# EAGLE design wifi (EAGLE 7.1.0)
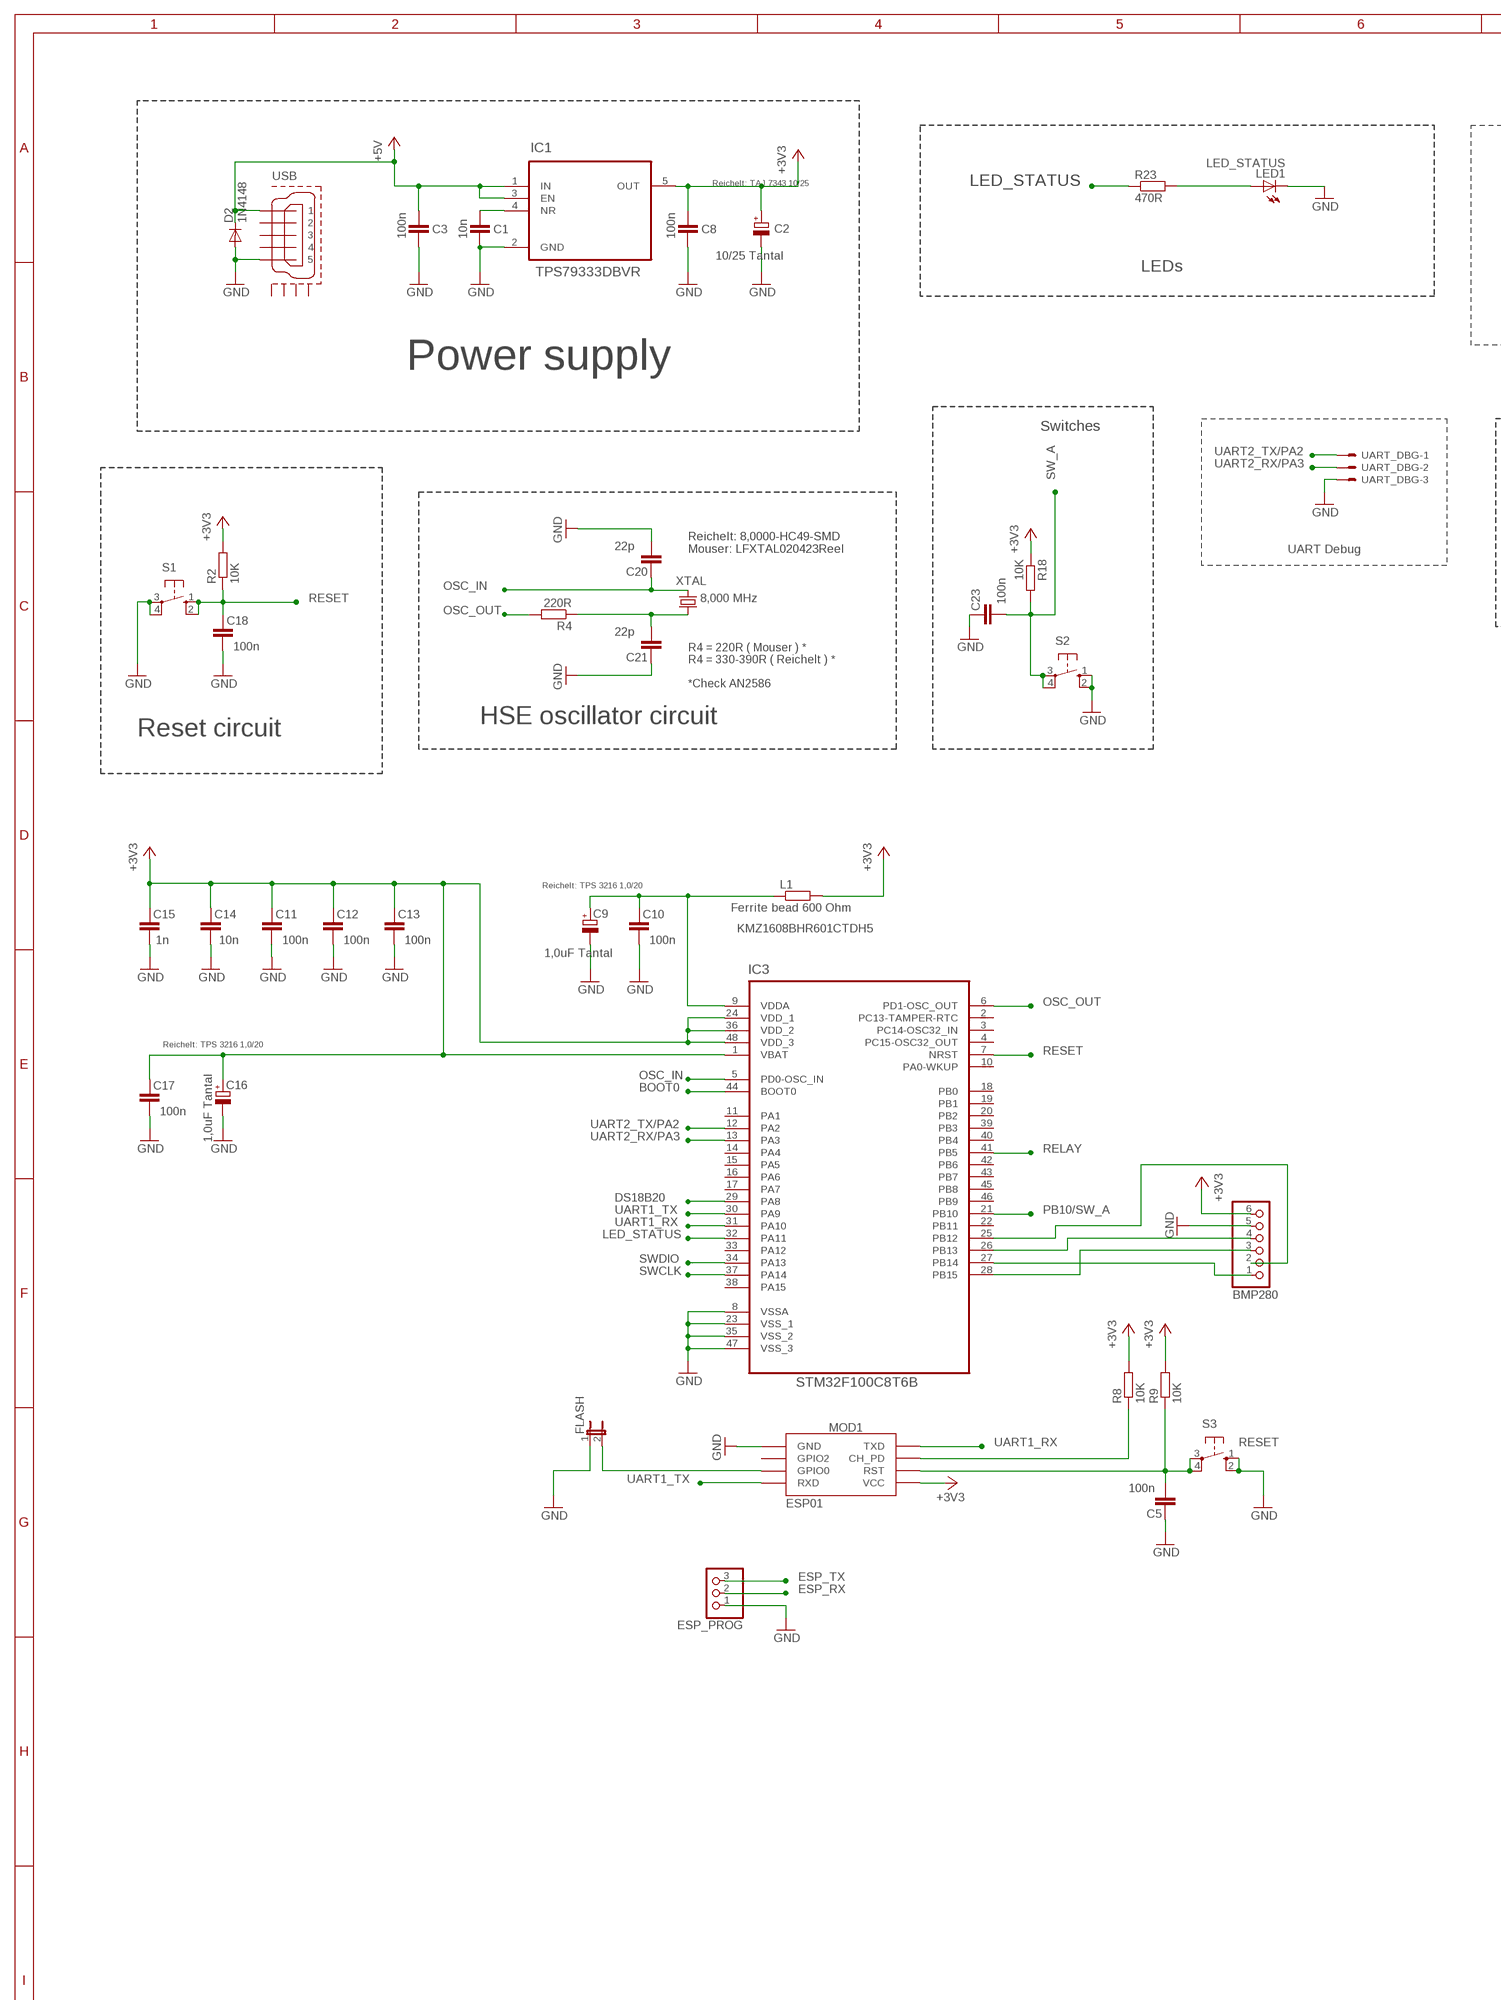
[diagram p0: schematic, sheet 1, part 1 of 2]
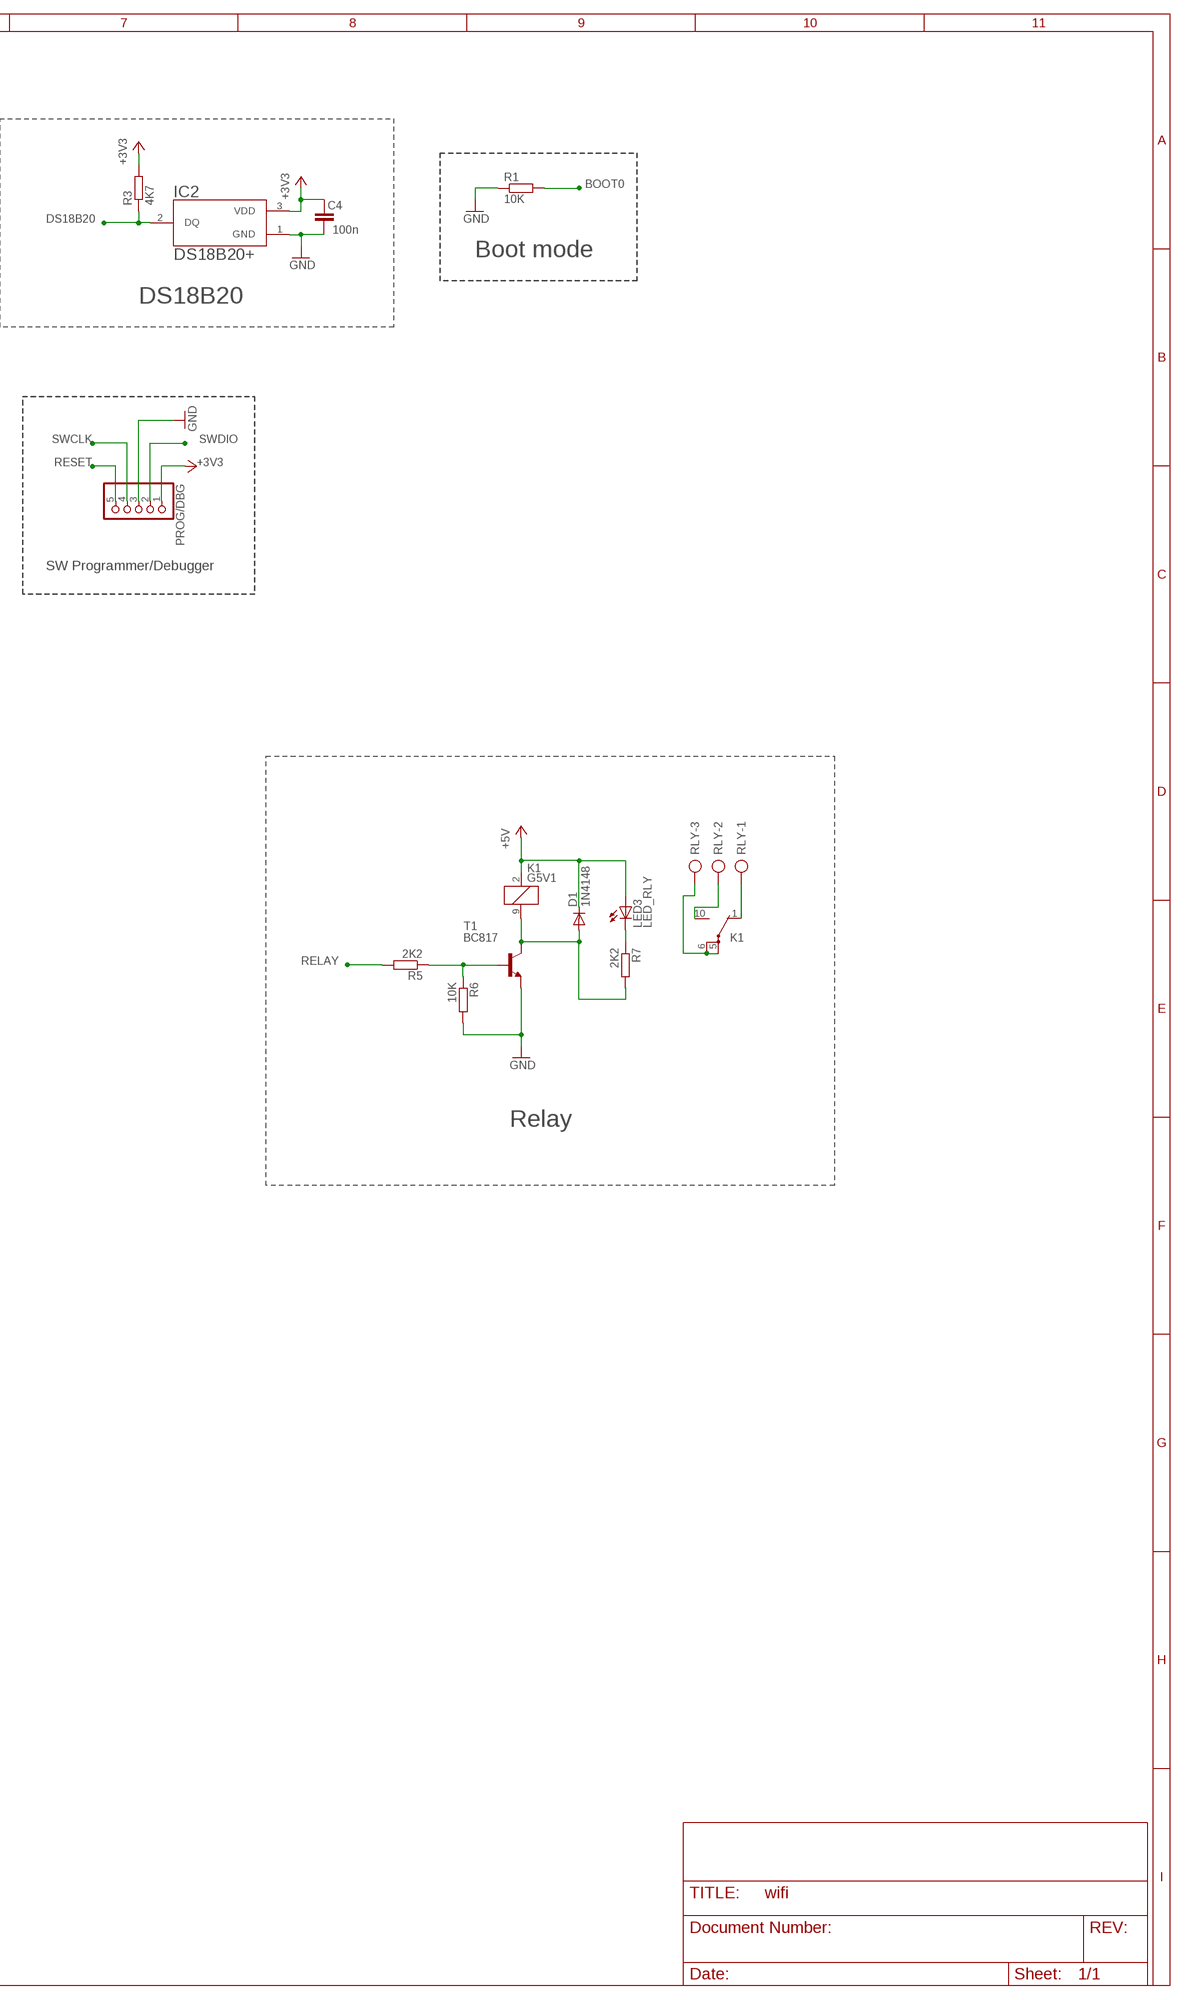
[diagram p1: schematic, sheet 1, part 2 of 2]

## Parts
BMP280  PINHD-1X6  [1X06]
C1  10n  C-EUC0805  [C0805]
C2  10/25 Tantal  CPOL-EUSMCD  [SMC_D]
C3  100n  C-EUC0805  [C0805]
C4  100n  C-EUC0805  [C0805]
C5  100n  C-EUC0805  [C0805]
C8  100n  C-EUC0805  [C0805]
C9  1,0uF Tantal  CPOL-EUSMCA  [SMC_A]
C10  100n  C-EUC0402K  [C0402K]
C11  100n  C-EUC0402K  [C0402K]
C12  100n  C-EUC0402K  [C0402K]
C13  100n  C-EUC0402K  [C0402K]
C14  10n  C-EUC0402K  [C0402K]
C15  1n  C-EUC0402K  [C0402K]
C16  1,0uF Tantal  CPOL-EUSMCA  [SMC_A]
C17  100n  C-EUC0402K  [C0402K]
C18  100n  C-EUC0603K  [C0603K]
C20  22p  C-EUC0603K  [C0603K]
C21  22p  C-EUC0603K  [C0603K]
C23  100n  C-EUC0805  [C0805]
D1  1N4148  1N4148DO35-7  [DO35-7]
D2  1N4148  1N4148DO35-7  [DO35-7]
ESP_PROG  PINHD-1X3  [1X03]
FLASH  JP1E  [JP1]
IC1  TPS79333DBVR  [SOT95P280X145-5N]
IC2  DS18B20+  [TO-92]
IC3  STM32F100C8T6B  [QFP50P900X900X160-48N]
K1  G5V1  [G5V1]
L1  Ferrite bead 600 Ohm  R-EU_R0603  [R0603]
LED1  LED_STATUS  LED3MM  [LED3MM]
LED3  LED_RLY  LED3MM  [LED3MM]
MOD1  ESP01  [ESP01]
PROG/DBG  PINHD-1X5  [1X05]
R1  10K  R-EU_R0805  [R0805]
R2  10K  R-EU_R0603  [R0603]
R3  4K7  R-EU_R0603  [R0603]
R4  220R  R-EU_R0603  [R0603]
R5  2K2  R-EU_R0603  [R0603]
R6  10K  R-EU_R0603  [R0603]
R7  2K2  R-EU_R0805  [R0805]
R8  10K  R-EU_R0603  [R0603]
R9  10K  R-EU_R0603  [R0603]
R18  10K  R-EU_M0805  [M0805]
R23  470R  R-EU_R0805  [R0805]
RLY  AK300/3  [AK300/3]
S1  10-XX  [B3F-10XX]
S2  10-XX  [B3F-10XX]
S3  10-XX  [B3F-10XX]
T1  BC817  BC817-25SMD  [SOT23-BEC]
UART_DBG  22-23-2031  [22-23-2031]
USB  MICRO-USB-RECEPTACLE47589-0001  [47589-0001]
XTAL  8,000 MHz  CRYSTALSM49  [SM49]

## Nets
+3V3: BMP280.6 C2.+ C4.1 C8.1 C11.1 C12.1 C13.1 C14.1 C15.1 C16.+ C17.1 IC1.5(OUT) IC2.3(VDD) IC3.1(VBAT) IC3.24(VDD_1) IC3.36(VDD_2) IC3.48(VDD_3) L1.2 MOD1.VCC PROG/DBG.1 R2.2 R3.2 R8.2 R9.2 R18.1
+5V: C3.1 D1.C D2.C IC1.1(IN) IC1.3(EN) K1.2 LED3.A USB.1
BOOT0: IC3.44(BOOT0) R1.2
DS18B20: IC2.2(DQ) IC3.29(PA8) R3.1
GND: BMP280.5 C1.2 C2.- C3.2 C4.2 C5.1 C8.2 C9.- C10.2 C11.2 C12.2 C13.2 C14.2 C15.2 C16.- C17.2 C18.2 C20.2 C21.1 C23.1 D2.A ESP_PROG.1 FLASH.1 IC1.2(GND) IC2.1(GND) IC3.8(VSSA) IC3.23(VSS_1) IC3.35(VSS_2) IC3.47(VSS_3) LED1.K(C) MOD1.GND PROG/DBG.3 R1.1 R6.2 S1.3(P) S1.4(P1) S2.1(S) S2.2(S1) S3.1(S) S3.2(S1) T1.E UART_DBG.3 USB.5
LED_STATUS: IC3.32(PA11) R23.1
N$2: C1.1 IC1.4(NR)
N$3: K1.1(2:O) RLY.1
N$4: C9.+ C10.1 IC3.9(VDDA) L1.1
N$5: K1.10(2:S) RLY.2
N$6: K1.5(2:P) K1.6(2:P) RLY.3
N$7: C21.2 R4.1 XTAL.2
N$8: D1.A K1.9 R7.2 T1.C
N$9: R5.1 R6.1 T1.B
N$10: LED3.K(C) R7.1
N$11: FLASH.2 MOD1.GPIO0
N$12: MOD1.CH_PD R8.1
N$13: C5.2 MOD1.RST R9.1 S3.3(P) S3.4(P1)
N$14: BMP280.4 IC3.26(PB13)
N$15: BMP280.3 IC3.28(PB15)
N$16: BMP280.2 IC3.25(PB12)
N$17: BMP280.1 IC3.27(PB14)
N$32: LED1.A R23.2
OSC_IN: C20.1 IC3.5(PD0-OSC_IN) XTAL.1
OSC_OUT: IC3.6(PD1-OSC_OUT) R4.2
PB10: C23.2 IC3.21(PB10) R18.2 S2.3(P) S2.4(P1)
RELAY: IC3.41(PB5) R5.2
RESET: C18.1 IC3.7(NRST) PROG/DBG.5 R2.1 S1.1(S) S1.2(S1)
SWCLK: IC3.37(PA14) PROG/DBG.4
SWDIO: IC3.34(PA13) PROG/DBG.2
UART1_RX: ESP_PROG.3 IC3.31(PA10) MOD1.TX(TXD)
UART1_TX: ESP_PROG.2 IC3.30(PA9) MOD1.RX(RXD)
UART2_RX: IC3.13(PA3) UART_DBG.2
UART2_TX: IC3.12(PA2) UART_DBG.1
Unconnected: IC3.2(PC13-TAMPER-RTC) IC3.3(PC14-OSC32_IN) IC3.4(PC15-OSC32_OUT) IC3.10(PA0-WKUP) IC3.11(PA1) IC3.14(PA4) IC3.15(PA5) IC3.16(PA6) IC3.17(PA7) IC3.18(PB0) IC3.19(PB1) IC3.20(PB2) IC3.22(PB11) IC3.33(PA12) IC3.38(PA15) IC3.39(PB3) IC3.40(PB4) IC3.42(PB6) IC3.43(PB7) IC3.45(PB8) IC3.46(PB9) MOD1.GPIO2 USB.2 USB.3 USB.4 USB.CASING1(GND1) USB.CASING2(GND2) USB.CASING3(GND3) USB.CASING4(GND4)

## Notes on the sheet
- Reichelt: TAJ 7343 10/25 | LED_STATUS
- BOOT0
- DS18B20
- LEDs | Boot mode
- DS18B20
- Power supply
- Switches
- UART2_TX/PA2
- UART2_RX/PA3 | SWCLK | SWDIO
- SW_A
- RESET
- Reichelt: 8,0000-HC49-SMD
  Mouser: LFXTAL020423Reel
- UART Debug
- OSC_IN
- RESET | SW Programmer/Debugger
- OSC_OUT
- R4 = 220R ( Mouser ) *
  R4 = 330-390R ( Reichelt ) *
  
  *Check AN2586
- HSE oscillator circuit
- Reset circuit
- Reichelt: TPS 3216 1,0/20
- KMZ1608BHR601CTDH5
- OSC_OUT
- RELAY
- Reichelt: TPS 3216 1,0/20
- RESET
- OSC_IN
- BOOT0
- UART2_TX/PA2
- UART2_RX/PA3
- RELAY
- Relay
- DS18B20
- UART1_TX | PB10/SW_A
- UART1_RX
- LED_STATUS
- SWDIO
- SWCLK
- PC13
- UART2_TX | PB3
- UART2_RX | PB4 | UART1_RX | RESET
- PB6/CA_CH1
- UART1_TX | PB7/CA_CH3
- PB10/SW_A
- PB11/SW_B
- ESP_TX
- ESP_RX

## Library data of the parts
BMP280 = pinhead:PINHD-1X6: PIN HEADER
C1 C3-C5 C8 C10-C15 C17 C18 C20 C21 C23 = resistor:C-EU: CAPACITOR, European symbol; SPICEPREFIX: C
C2 C9 C16 = resistor:CPOL-EU: POLARIZED CAPACITOR, European symbol
D1 D2 = diode:1N4148: DIODE high speed (Philips)
ESP_PROG = pinhead:PINHD-1X3: PIN HEADER
FLASH = jumper:JP1E: JUMPER
IC1 = TPS79333DBVR:TPS79333DBVR: LOW-DROPOUT LINEAR REGULATORS; AVAILABILITY: Good; DESCRIPTION: Single Output LDO%2C 200mA%2C Fixed%283.3V%29%2C High PSRR%2C Low Noise 5-SOT-23 -40 to 125; MF: Texas Instruments; MP: TPS79333DBVR; PACKAGE: SOT-23-5 Texas Instruments; PRICE: 0.37 USD
IC2 = DS18B20_:DS18B20+: Temperature sensor; digital thermometer; -55÷125°C; TO92; THT; AVAILABILITY: Good; DESCRIPTION: Temperature sensor; digital thermometer; -55÷125°C; TO92; THT; MF: Maxim Integrated; MP: DS18B20+; PACKAGE: TO-92 Maxim Integrated; PRICE: 3.03 USD
IC3 = STM32F100C8T6B:STM32F100C8T6B: ARM-based 32-bit MCU; AVAILABILITY: Good; DESCRIPTION: Mainstream Value line%2C ARM Cortex-M3 MCU with 64 Kbytes Flash%2C 24 MHz CPU%2C motor control and CEC functions; MF: STMicroelectronics; MP: STM32F100C8T6B; PACKAGE: LQFP-48 STMicroelectronics; PRICE: 2.82 USD
K1 = relay:G5V1: RELAY 1 x switch, 0.5 A/125 V AC, 1 A/24 V DC , Omron; MPN: G5V-1-DC24; OC_FARNELL: 9949593; OC_NEWARK: 36M6377
L1 R1-R9 R18 R23 = resistor:R-EU_: RESISTOR, European symbol; SPICEPREFIX: R
LED1 LED3 = led:LED: LED OSRAM: - CHIPLED LG R971, LG N971, LY N971, LG Q971, LY Q971, LO R971, LY R971 LH N974, LH R974 LS Q976, LO Q976, LY Q976 LO Q996 - Hyper CHIPLED LW Q18S LB Q993, LB Q99A, LB R99A - SideLED LS A670, LO A670, LY A670, LG A670, LP A670 LB A673, LV A673, LT A673, LW A673 LH A674 LY A675 LS A676, LA A676, LO A676, LY A676, LW A676 LS A679, LY A679, LG A679 - Hyper Micro SIDELED® LS Y876, LA Y876, LO Y876, LY Y876 LT Y87S - SmartLED LW L88C, LW L88S LB L89C, LB L89S, LG L890 LS L89K, LO L89K, LY L89K LS L896, LA L896, LO L896, LY L896 - TOPLED LS T670, LO T670, LY T670, LG T670, LP T670 LSG T670, LSP T670, LSY T670, LOP T670, LYG T670 LG T671, LOG T671, LSG T671 LB T673, LV T673, LT T673, LW T673 LH T674 LS T676, LA T676, LO T676, LY T676, LB T676, LH T676, LSB T676, LW T676 LB T67C, LV T67C, LT T67C, LS T67K, LO T67K, LY T67K, LW E67C LS E67B, LA E67B, LO E67B, LY E67B, LB E67C, LV E67C, LT E67C LW T67C LS T679, LY T679, LG T679 LS T770, LO T770, LY T770, LG T770, LP T770 LB T773, LV T773, LT T773, LW T773 LH T774 LS E675, LA E675, LY E675, LS T675 LS T776, LA T776, LO T776, LY T776, LB T776 LHGB T686 LT T68C, LB T68C - Hyper Mini TOPLED® LB M676 - Mini TOPLED Santana® LG M470 LS M47K, LO M47K, LY M47K Source: http://www.osram.convergy.de LUXEON: - LUMILED® LXK2-PW12-R00, LXK2-PW12-S00, LXK2-PW14-U00, LXK2-PW14-V00 LXK2-PM12-R00, LXK2-PM12-S00, LXK2-PM14-U00 LXK2-PE12-Q00, LXK2-PE12-R00, LXK2-PE12-S00, LXK2-PE14-T00, LXK2-PE14-U00 LXK2-PB12-K00, LXK2-PB12-L00, LXK2-PB12-M00, LXK2-PB14-N00, LXK2-PB14-P00, LXK2-PB14-Q00 LXK2-PR12-L00, LXK2-PR12-M00, LXK2-PR14-Q00, LXK2-PR14-R00 LXK2-PD12-Q00, LXK2-PD12-R00, LXK2-PD12-S00 LXK2-PH12-R00, LXK2-PH12-S00 LXK2-PL12-P00, LXK2-PL12-Q00, LXK2-PL12-R00 Source: www.luxeon.com KINGBRIGHT: KA-3528ASYC Source: www.kingbright.com
MOD1 = esp8266_libs:ESP01: ESP8266 Wifi module 01
PROG/DBG = pinhead:PINHD-1X5: PIN HEADER
RLY = con-ptr500:AK300/3: CONNECTOR; OC_FARNELL: unknown; OC_NEWARK: unknown
S1-S3 = switch-omron:10-XX: OMRON SWITCH; MPN: B3F-1000; OC_FARNELL: 176432; OC_NEWARK: 36M3542
T1 = transistor-npn:BC817*: NPN Transistor
UART_DBG = con-molex:22-23-2031: .100" (2.54mm) Center Header - 3 Pin; MF: MOLEX; MPN: 22-23-2031; OC_FARNELL: 1462950; OC_NEWARK: 30C0862
USB = con-molex-usb:MICRO-USB-RECEPTACLE: MICRO USB RECEPTACLES Micro-USB Receptacles, SMT, Lead-Free from MOLEX <http://www.molex.com/>. (C) 2014 Tomasz Boleslaw CEDRO, cederom@tlen.pl, http://www.tomek.cedro.info. Version 0.1 (2014-01-17): Initial release. Version 0.2 (2014-02-06): Updated 47589-0001 footprint pins/pads/milling. Following devices are included: 1. 47589-0001 Micro-USB AB Receptacle, Bottom Mount, SMT, Lead-Free <http://www.molex.com/molex/products/datasheet.jsp?part=active/0475890001_IO_CONNECTORS.xml> (Technical Drawing <http://www.molex.com/pdm_docs/sd/475890001_sd.pdf>).
XTAL = crystal:CRYSTAL: CRYSTAL; OC_FARNELL: unknown; OC_NEWARK: unknown

## Net classes
0 default: width 0.305 mm, clearance 0.305 mm
1 power: width 1.524 mm

## Board
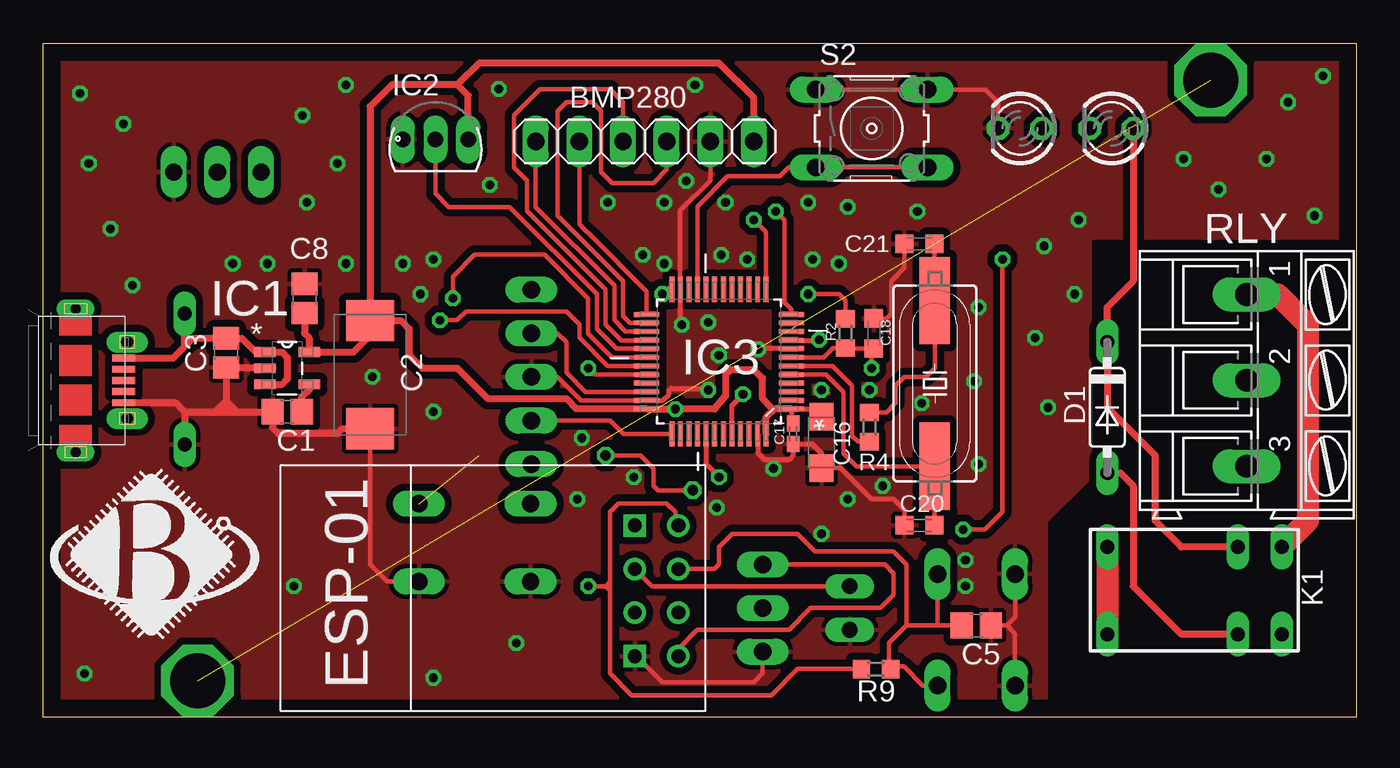
[diagram p2: board, top side]
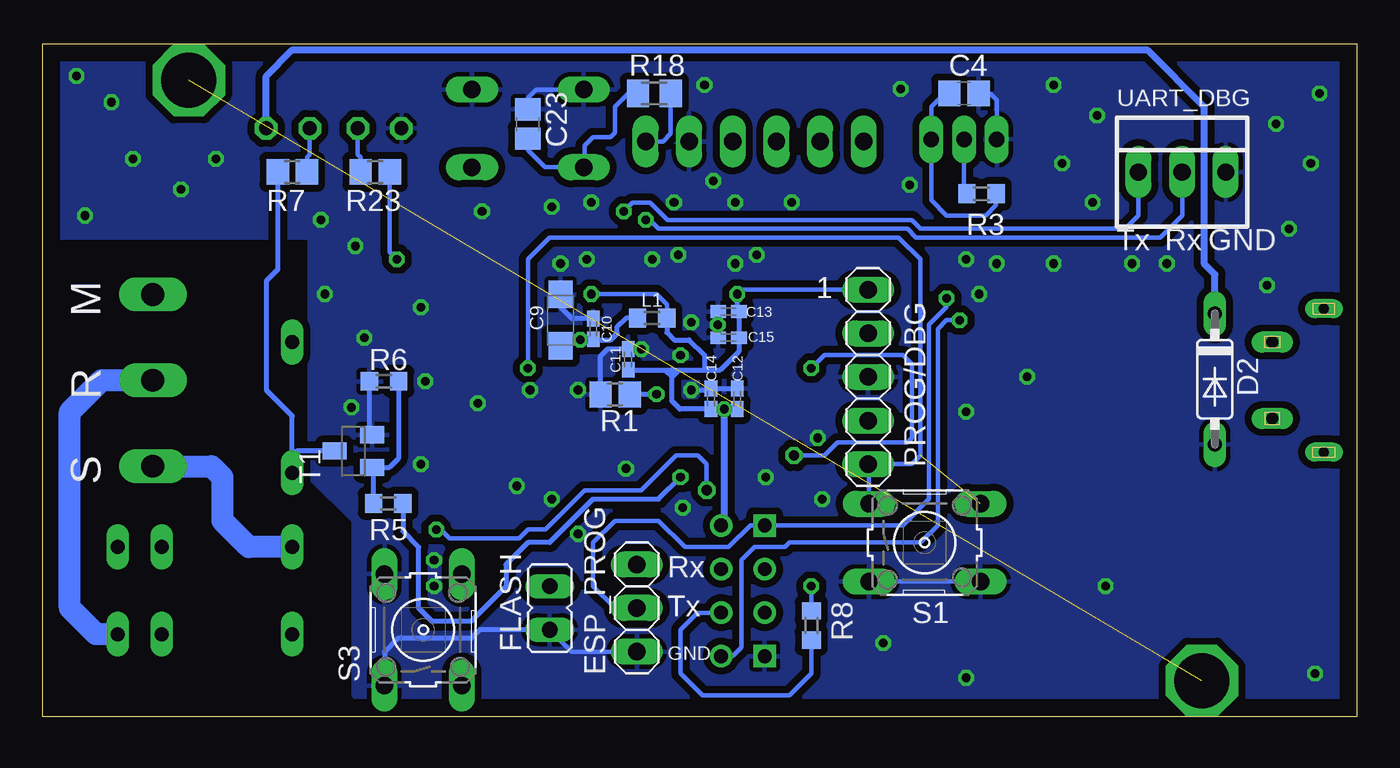
[diagram p3: board, bottom side, seen from below]

Size 76.5 x 39.22 mm. Coordinates in mm from the lower left corner, seen from the top.
Outline: 0,0 76.5,0 76.5,39.22 0,39.22 0,0
Copper layers (1*16): Top 0.035mm / dielectric 1.5mm / Bottom 0.035mm
Design rules "default": minimum track width 10mil, minimum drill 24mil, track to track 8mil, track to pad 8mil, pad to pad 8mil, via to via 8mil, smd to smd 8mil, copper to edge 40mil, drill to drill 8mil, minimum pad ring 10mil, minimum via ring 8mil, stop-mask expansion 4mil, vias tented up to drill 0mil, thermal gap 10mil

### Footprints (pad centres in the part's own frame; a part is rotated, then mirrored left to right if it is on the bottom)
1X06 = drill 1.016 long: 1 -6.35,0; 2 -3.81,0; 3 -1.27,0; 4 1.27,0; 5 3.81,0; 6 6.35,0
C0805 = smd 1.3 x 1.5: 1 -0.85,0; 2 0.85,0
SMC_D = smd 2.4 x 2.8: + -3.15,0; - 3.15,0
SMC_A = smd 1.6 x 1.4: + -1.5,0; - 1.5,0
C0402K = smd 0.925 x 0.74: 1 -0.6,0; 2 0.6,0
C0603K = smd 1.05 x 1.08: 1 -0.875,0; 2 0.875,0
DO35-7 = drill 0.813 long: A 3.81,0; C -3.81,0
1X03 = drill 1.016 long: 1 -2.54,0; 2 0,0; 3 2.54,0
JP1 = drill 0.914 long: 1 0,-1.27; 2 0,1.27
SOT95P280X145-5N = smd 1.27 x 0.559: 1 -1.295,0.94; 2 -1.295,0; 3 -1.295,-0.94; 4 1.295,-0.94; 5 1.295,0.94
TO-92 = drill 0.9 pad 1.1 long: 1 -1.905,-0.635; 2 0,-0.635; 3 1.905,-0.635
QFP50P900X900X160-48N = smd 1.473 x 0.279: 1 -4.216,2.743; 2 -4.216,2.261; 3 -4.216,1.753; 4 -4.216,1.245; 5 -4.216,0.762; 6 -4.216,0.254; 7 -4.216,-0.254; 8 -4.216,-0.762; 9 -4.216,-1.245; 10 -4.216,-1.753; 11 -4.216,-2.261; 12 -4.216,-2.743; 25 4.216,-2.743; 26 4.216,-2.261; 27 4.216,-1.753; 28 4.216,-1.245; 29 4.216,-0.762; 30 4.216,-0.254; 31 4.216,0.254; 32 4.216,0.762; 33 4.216,1.245; 34 4.216,1.753; 35 4.216,2.261; 36 4.216,2.743 | smd 0.279 x 1.473: 13 -2.743,-4.216; 14 -2.261,-4.216; 15 -1.753,-4.216; 16 -1.245,-4.216; 17 -0.762,-4.216; 18 -0.254,-4.216; 19 0.254,-4.216; 20 0.762,-4.216; 21 1.245,-4.216; 22 1.753,-4.216; 23 2.261,-4.216; 24 2.743,-4.216; 37 2.743,4.216; 38 2.261,4.216; 39 1.753,4.216; 40 1.245,4.216; 41 0.762,4.216; 42 0.254,4.216; 43 -0.254,4.216; 44 -0.762,4.216; 45 -1.245,4.216; 46 -1.753,4.216; 47 -2.261,4.216; 48 -2.743,4.216
G5V1 = drill 0.813 long: 1 -5.08,-2.54; 2 -2.54,-2.54; 5 5.08,-2.54; 6 5.08,2.54; 9 -2.54,2.54; 10 -5.08,2.54
R0603 = smd 1 x 1.1: 1 -0.85,0; 2 0.85,0
LED3MM = drill 0.813 octagon: A -1.27,0; K 1.27,0
ESP01 = drill 0.8: CH_PD -1.285,-8.178; GPIO0 1.255,-5.638; GPIO2 -1.285,-5.638; RST 1.255,-8.178; TX -3.825,-8.178; VCC 3.795,-8.178 | drill 0.8 square: GND -3.825,-5.638; RX 3.795,-5.638
1X05 = drill 1.016 long: 1 -5.08,0; 2 -2.54,0; 3 0,0; 4 2.54,0; 5 5.08,0
R0805 = smd 1.3 x 1.5: 1 -0.85,0; 2 0.85,0
M0805 = smd 1.3 x 1.6: 1 -0.95,0; 2 0.95,0
AK300/3 = drill 1.321 long: 1 -5.004,0; 2 0,0; 3 5.004,0
B3F-10XX = drill 1.016 long: 1 -3.251,2.261; 2 3.251,2.261; 3 -3.251,-2.261; 4 3.251,-2.261
SOT23-BEC = smd 1 x 1.4: B -0.95,-1.1; C 0,1.1; E 0.95,-1.1
22-23-2031 = drill 1 long: 1 -2.54,0; 2 0,0; 3 2.54,0
47589-0001 = smd 1.35 x 0.4: 1 2.8,1.3; 2 2.8,0.65; 3 2.8,0; 4 2.8,-0.65; 5 2.8,-1.3 | drill 0.6 pad 0.95 long: CASING1 0,4.175; CASING2 0,-4.175 | drill 0.7 pad 1.1 long: CASING3 3,2.225; CASING4 3,-2.225
SM49 = smd 5.08 x 1.778: 1 -4.826,0; 2 4.826,0

### Placement (x,y rotation side)
BMP280  35.05,33.53 0 top
C1  14.22,17.78 180 top
C2  19.05,19.94 270 top
C3  10.67,21.21 270 top
C4  22.86,36.32 0 bottom
C5  54.36,5.33 180 top
C8  15.24,24.38 90 top
C9  46.35,23.11 90 bottom
C10  44.45,22.61 90 bottom
C11  42.42,20.83 90 bottom
C12  36.07,18.54 90 bottom
C13  36.58,23.62 180 bottom
C14  37.59,18.54 90 bottom
C15  36.58,22.1 180 bottom
C16  45.34,16 270 top
C17  43.69,16.51 270 top
C18  48.39,22.35 90 top
C20  51.05,11.18 180 top
C21  51.05,27.56 0 top
C23  48.26,34.54 270 bottom
D1  61.98,18.03 270 top
D2  8.26,19.68 270 bottom
ESP_PROG  41.91,6.35 90 bottom
FLASH  46.99,6.35 0 bottom
IC1  14.22,20.32 0 top
IC2  22.86,34.29 0 top
IC3  39.37,20.7 180 top
K1  67.06,7.37 180 top
L1  41.02,23.24 0 bottom
LED1  56.9,34.29 180 top
LED3  62.23,34.29 180 top
MOD1  28.83,7.37 90 top
PROG/DBG  28.45,19.81 270 bottom
R1  43.18,18.8 0 bottom
R2  46.74,22.35 90 top
R3  21.84,30.48 0 bottom
R4  48.13,16.89 270 top
R5  56.39,12.45 0 bottom
R6  56.64,19.56 180 bottom
R7  61.98,31.75 180 bottom
R8  31.75,5.33 90 bottom
R9  48.51,2.79 180 top
R18  40.89,36.32 180 bottom
R23  57.15,31.75 180 bottom
RLY  70.1,19.61 270 top
S1  25.15,10.16 0 bottom
S2  48.26,34.29 0 top
S3  54.36,5.08 90 bottom
T1  58.42,15.49 90 bottom
UART_DBG  10.16,31.75 0 bottom
USB  1.91,19.61 0 top
XTAL  51.94,19.43 90 top

### Tracks (layer width: path | path; a pad name or v marks a point on that pad's centre or on a via)
+3V3  (via drill 0.5)
  Top 0.254: R2.2 46.74,24.26 46.35,24.64 v44.58,24.64 | R9.2 43.94,2.79 42.42,1.27 34.29,1.27 33.02,2.54 33.02,7.37 | 33.02,7.37 33.02,7.62 | 33.02,7.87 33.02,11.94 33.53,12.45 36.32,12.45 36.83,11.94 36.83,11.34 MOD1.VCC | v31.75,7.62 32.77,7.62 | 32.77,7.62 33.02,7.62 | 33.02,7.62 33.02,7.87 | 33.02,7.87 32.77,7.62 | 32.77,7.62 33.02,7.37
  Top 0.305: 44.88,17.96 IC3.1 43.59,17.21 C17.1 | 36.81,17.96 v36.83,17.94 | IC3.24 36.35,24.92 v36.07,24.64 | 15.49,21.29 IC1.5
  Top 0.406: IC1.5 18.09,21.26 19.05,22.23 C2.+ | 44.88,17.96 C16.+ | IC3.1 42.6,17.96 | 42.6,17.96 42.11,17.48 IC3.48 | 36.81,17.96 IC3.36 31.06,17.96 30.48,18.54 25.91,18.54 24.13,20.32 22.1,20.32 21.34,21.08 21.34,22.61 20.85,23.09 C2.+ | 36.85,17.96 v36.83,17.94 39.12,17.94 39.75,18.7 39.75,19.94 40.04,20.23 41.4,20.23 41.91,19.72 41.91,18.54 42.49,17.96 42.6,17.96 | IC2.3 24.77,36.2 24.13,36.83 | 24.13,36.83 20.32,36.83 19.05,35.56 C2.+ | BMP280.6 41.4,36.07 39.37,38.1 25.4,38.1 24.13,36.83 | C8.1 15.24,22.35 15.49,22.1 15.49,21.29
  Bottom 0.254: v44.58,24.64 40.77,24.64 40.17,24.04 L1.2 | PROG/DBG.1 35.81,24.89 v36.07,24.64 | R3.2 20.99,29.81 21.59,29.21 23.88,29.21 24.77,30.1 IC2.3 24.77,35.56 24,36.32 C4.1 | R18.1 39.94,33.97 40.39,33.53 BMP280.6 | R8.2 v31.75,7.62
  Bottom 0.305: C12.1 v36.83,17.94 C14.1 39.41,17.94 39.88,18.41 39.88,19.81 | v36.07,24.64 36.07,23.71 C13.1 C15.1 35.98,21.3 37.05,20.23 37.97,20.23 | C11.1 39.88,20.23 | 39.88,20.23 37.97,20.23 | 39.88,20.23 39.88,19.81 | 39.88,19.81 40.26,20.19 39.5,20.19 39.88,19.81 | 37.97,20.23 37.97,21.08 38.86,21.97 39.75,21.97 40.17,22.39 L1.2
  Bottom 0.406: v36.83,17.94 36.83,11.34 MOD1.VCC
+5V
  Top 0.406: USB.1 7.58,20.91 8.26,21.59 | 8.26,21.59 D2.C | 8.26,21.59 8.72,22.06 C3.1 11.6,22.06 12.39,21.26 IC1.1 13.92,21.26 14.22,20.95 14.22,19.68 13.92,19.38 IC1.3 | K1.2 66.29,9.91 64.77,11.43 64.77,15.24 61.98,18.03 D1.C 61.98,23.88 63.5,25.4 LED3.A
  Bottom 0.406: LED3.A 63.5,37.34 61.98,38.86 12.19,38.86 8.89,35.56 8.89,26.42 8.26,25.78 D2.C
BOOT0  (via drill 0.5)
  Top 0.305: IC3.44 40.13,18.16 v40.77,18.8
  Bottom 0.305: v40.77,18.8 R1.2
DS18B20
  Top 0.254: IC3.29 33.4,21.46 32.26,22.61 32.26,24.64 27.18,29.72 23.62,29.72 22.86,30.48 IC2.2
  Bottom 0.254: IC2.2 22.86,30.65 R3.1
GND  (via drill 0.5)
  Top 0.254: IC3.35 31.34,18.44 29.97,19.81 PROG/DBG.3 | C16.- 46.46,14.5 48.26,12.7 49.53,12.7 50.18,12.05 C20.2 50.18,10.78 | C18.2 49.13,23.23 49.4,23.5 49.4,25.4 50.18,26.18 C21.1 | IC3.23 37.11,29.49 38.86,31.24 BMP280.5 | MOD1.GND 34.56,3.54 36.07,2.03 41.4,2.03 41.91,2.54 ESP_PROG.1 | S2.1 S2.2 54.89,36.55 55.63,35.81 LED1.K | C2.- 19.05,8.89 20.04,7.9 S1.4 | S3.1 56.62,4.85 56.13,5.33 | 56.13,5.33 C5.1 | 56.13,5.33 56.64,5.84 56.64,8.31
  Top 0.305: IC3.47 41.63,15.39 42.04,14.99 43.43,14.99 43.69,15.24 C17.2 44.8,15.91 45.34,15.37 C16.- | IC3.8 41.69,21.46 v41.66,21.43 | IC3.35 36.09,18.44 36.45,18.8 36.45,19.02 36.58,19.14 38.64,19.14 v38.73,19.05 | IC3.23 37.11,22.96 v37.21,22.86 | 56.64,8.31 S3.2
  Top 0.406: USB.5 7.72,18.31 8.26,17.78 | 8.26,17.78 D2.A | C3.2 12.89,20.36 IC1.2 10.67,20.32 10.67,18.41 | C2.- 17.42,16.79 17.14,16.51 13.72,16.51 13.37,16.85 C1.2 11.3,17.78 | 8.26,17.78 10.03,17.78 | 10.03,17.78 10.67,17.78 | 10.67,18.41 10.67,17.78 | 10.67,18.41 10.03,17.78 | 10.67,17.78 11.3,17.78 | 11.3,17.78 10.67,18.41
  Bottom 0.254: 46.38,24.64 C9.- | IC2.1 20.95,35.94 21.34,36.32 C4.2 | ESP_PROG.1 45.72,3.81 FLASH.1 | S2.1 47.78,36.55 48.26,36.07 C23.1 | S1.4 S1.3
  Bottom 0.305: v41.66,21.43 C11.2 | C12.2 C14.2 37.68,19.05 v38.73,19.05 | v37.21,22.86 37.21,23.59 C13.2 C15.2 | v41.66,21.43 41.66,21.46 | R1.1 44.03,21.02 IC3.8 41.69,21.46 v41.66,21.43 | C9.- 46.35,23.88 45.69,23.21 C10.2 | R6.2 57.49,16.62 T1.E | FLASH.1 51.05,5.08 51.56,4.57 55.85,4.57 56.62,3.81 S3.1
  other vias: 39.37,21.08 38.73,22.99 48.13,19.05 45.34,19.05 31.37,16.26 42.55,14.48 39.24,12.19 34.42,13.97 31.11,12.7 27.56,4.32 22.73,2.29 14.61,7.62 2.41,2.54 5.21,25.15 11.05,26.42 13.08,26.42 17.65,26.42 20.95,26.42 21.97,24.64 19.18,19.81 22.73,17.78 3.94,28.45 2.67,32.26 2.16,36.32 4.7,34.54 15.37,29.97 17.14,32.26 15.11,35.05 17.65,36.83 26.04,30.99 22.73,26.67 26.54,36.58 37.97,36.83 32.89,29.97 36.2,29.97 37.47,31.24 39.75,29.97 44.58,29.97 34.92,26.92 36.2,26.42 39.5,26.92 41.02,26.67 44.83,26.67 46.35,26.42 45.34,10.67 48.9,13.46 46.86,12.7 53.72,9.14 53.72,7.62 51.18,18.29 54.48,23.88 54.23,19.56 54.48,14.73 58.55,18.03 57.78,22.1 60.07,24.64 58.29,27.43 46.86,29.72 50.93,29.46 60.33,28.96 72.52,35.81 74.55,37.34 66.42,32.51 71.25,32.51 68.45,30.73 74.04,29.21
  pour Bottom (isolate 0.406): 0,39.37 76.2,39.37 76.2,27.94 60.96,27.94 60.96,13.97 58.42,11.43 58.42,1.27 57.15,0 0,0
  pour Top (isolate 0.406): 0,39.37 76.2,39.37 76.2,27.94 60.96,27.94 60.96,13.97 58.42,11.43 58.42,0 0,0
LED_STATUS  (via drill 0.5, 0.6)
  Top 0.254: IC3.32 32.13,19.94 v31.75,20.32 | v55.88,26.67 55.88,11.94 54.86,10.92 v53.59,10.92 | v37.85,13.21 35.81,13.21 35.56,13.46 35.56,14.48 34.8,15.24 v32.77,15.24
  Bottom 0.254: v31.75,20.32 30.99,21.08 26.42,21.08 25.91,20.57 25.91,16.26 26.16,16 30.23,16 30.99,15.24 v32.77,15.24 | R23.1 56.3,27.09 v55.88,26.67 | v53.59,10.92 53.34,10.92 52.83,10.41 48.77,10.41 48.26,10.92 47.24,10.92 44.96,13.21 41.66,13.21 39.62,15.24 38.35,15.24 37.85,14.73 v37.85,13.21
N$2
  Top 0.406: IC1.4 15.52,19.07 15.07,18.63 C1.1
N$3
  Top 1.27: RLY.1 71.91,24.61 73.66,22.86 73.66,11.43 K1.1
N$4  (via drill 0.5)
  Top 0.305: IC3.9 45.19,21.95 v45.21,21.97
  Bottom 0.305: 44.45,21.97 v45.21,21.97 46,21.97 C9.+ | 44.45,21.97 43.43,21.97 43.05,22.35 43.05,22.73 42.55,23.24 L1.1 | C10.1 44.45,21.97
N$5
  Bottom 1.27: K1.10 73.41,4.83 74.93,6.35 74.93,17.78 73.1,19.61 RLY.2
N$6
  Top 1.27: K1.5 K1.6
  Bottom 1.27: RLY.3 66.68,14.61 66.04,13.97 66.04,11.43 64.52,9.91 K1.5
N$7
  Top 0.254: C21.2 51.93,24.27 XTAL.2 51.94,20.32 51.44,19.81 50.16,19.81 49.66,19.3 49.66,18.29 49.11,17.74 R4.1
N$8
  Top 0.406: K1.9 66.29,4.83 63.5,7.62 63.5,13.46 62.74,14.22 D1.A
  Bottom 0.305: R7.2 62.83,26.07 63.5,25.4 63.5,19.05 61.98,17.53 61.98,15.24 | D1.A 61.98,15.24 | T1.C 61.72,15.49 61.98,15.24
N$9
  Bottom 0.305: R5.1 57.24,14.46 T1.B 56.32,14.54 55.79,15.07 R6.1
N$10
  Bottom 0.254: R7.1 61.13,32.6 60.96,32.77 LED3.K
N$11
  Top 0.254: FLASH.2 35.47,7.62 MOD1.GPIO0
N$12
  Bottom 0.254: R8.1 31.75,2.54 33.02,1.27 38.1,1.27 39.37,2.54 39.37,5.08 38.37,6.08 MOD1.CH_PD
N$13
  Top 0.254: MOD1.RST 39.1,8.62 39.37,8.89 39.37,9.91 40.13,10.67 43.94,10.67 44.96,9.65 49.53,9.65 50.29,8.89 50.29,5.33 | S3.3 51.26,1.83 50.13,2.96 49.53,2.96 R9.1 49.28,2.88 49.28,4.32 50.29,5.33 | C5.2 52.07,5.33 | 52.07,5.33 50.29,5.33 | S3.4 52.09,5.36 52.07,5.33
N$14
  Top 0.254: BMP280.4 36.32,31.88 35.56,31.11 33.15,31.11 32.51,31.75 32.51,35.31 32,35.81 30.48,35.81 29.97,35.31 29.97,29.21 33.78,25.4 33.78,23.37 34.19,22.96 IC3.26
N$15
  Top 0.254: IC3.28 33.68,21.95 32.77,22.86 32.77,24.89 28.19,29.46 28.19,31.24 27.43,32 27.43,35.05 28.96,36.58 33.02,36.58 33.78,35.81 BMP280.3
N$16
  Top 0.254: IC3.25 35.15,24.79 31.88,28.07 31.5,28.45 31.24,28.7 BMP280.2
N$17
  Top 0.254: IC3.27 33.93,22.45 33.27,23.11 33.27,25.15 28.7,29.72 BMP280.1
N$18  (via drill 3.2)  (1 unrouted)
  other vias: 9,2.11 68,37.11
N$32
  Bottom 0.254: R23.2 58,32.6 58.17,32.77 LED1.A
OSC_IN
  Top 0.254: IC3.5 45.59,19.94 46.61,18.92 46.61,15.37 47.37,14.61 XTAL.1 51.93,14.59 C20.1
OSC_OUT
  Top 0.254: IC3.6 45.97,20.45 47.12,19.3 47.12,16.38 47.46,16.04 R4.2
PB10
  Top 0.254: IC3.21 38.12,29.74 39.88,31.5 42.93,31.5 43.46,32.03 44.45,32.03 S2.3 S2.4
  Bottom 0.254: C23.2 48.26,33.02 47.27,32.03 S2.3 44.96,32.08 44.96,33.27 44.45,33.78 43.43,33.78 43.18,34.04 43.18,35.56 42.42,36.32 R18.2
RELAY  (via drill 0.5)
  Top 0.305: IC3.41 38.61,14.73 v39.37,13.97
  Bottom 0.305: v39.37,13.97 40.64,12.7 44.45,12.7 46.99,10.16 48.26,10.16 49.53,8.89 49.53,7.62 51.56,5.59 53.85,5.59 54.61,6.35 54.61,9.91 55.54,10.83 R5.2
RESET  (via drill 0.5)  (1 unrouted)
  Top 0.254: IC3.7 45.47,20.95 46.01,21.5 R2.1 46.76,21.48 C18.1 48.26,21.35 v48.26,20.32
  Bottom 0.254: v48.26,20.32 48.26,26.67 46.99,27.94 26.67,27.94 25.4,26.67 25.4,15.24 25.91,14.73 PROG/DBG.5 28.4,14.68 S1.1
SWCLK
  Top 0.254: IC3.37 33.81,16.48 33.02,17.27 PROG/DBG.4
SWDIO
  Top 0.254: IC3.34 31.6,18.95 30.48,20.07 30.48,21.84 29.97,22.35 PROG/DBG.2
UART1_RX  (via drill 0.5)
  Top 0.254: IC3.31 32.89,20.45 31.24,22.1 31.24,22.86 30.48,23.62 24.64,23.62 24.13,23.11 v23.11,23.11 | ESP_PROG.3 49.02,8.89 49.53,8.38 49.53,7.11 48.77,6.35 44.7,6.35 43.43,5.08 38.1,5.08 37.01,3.99 MOD1.TX
  Bottom 0.254: v23.11,23.11 23.88,23.11 24.38,22.61 24.38,11.18 25.4,10.16 33.02,10.16 33.27,9.91 35.05,9.91 35.81,9.14 35.81,4.06 36.32,3.56 36.99,3.56 MOD1.TX
UART1_TX  (via drill 0.5)
  Top 0.254: IC3.30 33.15,20.95 31.75,22.35 31.75,24.38 29.21,26.92 25.15,26.92 23.88,25.65 v23.88,24.38
  Bottom 0.254: v23.88,24.38 23.88,23.88 24.89,22.86 24.89,12.7 26.42,11.18 34.45,11.18 MOD1.RX 34.48,11.18 35.31,11.18 36.58,9.91 39.12,9.91 40.64,11.43 43.18,11.43 44.45,10.16 44.45,7.62 43.18,6.35 ESP_PROG.2
UART2_RX  (via drill 0.5)
  Top 0.254: IC3.13 42.11,28.25 v41.4,28.96
  Bottom 0.254: v41.4,28.96 41.15,28.96 40.64,28.45 26.16,28.45 25.65,27.94 11.43,27.94 10.16,29.21 UART_DBG.2
UART2_TX  (via drill 0.5)
  Top 0.254: IC3.12 43.59,23.72 43.18,24.13 43.18,28.96 v42.67,29.46
  Bottom 0.254: v42.67,29.46 42.16,29.97 41.15,29.97 40.13,28.96 25.91,28.96 25.4,28.45 13.46,28.45 12.7,29.21 UART_DBG.1

### Text on the board
bNames: GND | Rx | Tx | M | 1 | R | S | Rx | Tx | GND